# EAGLE schematic LS (EAGLE 8.6.0)
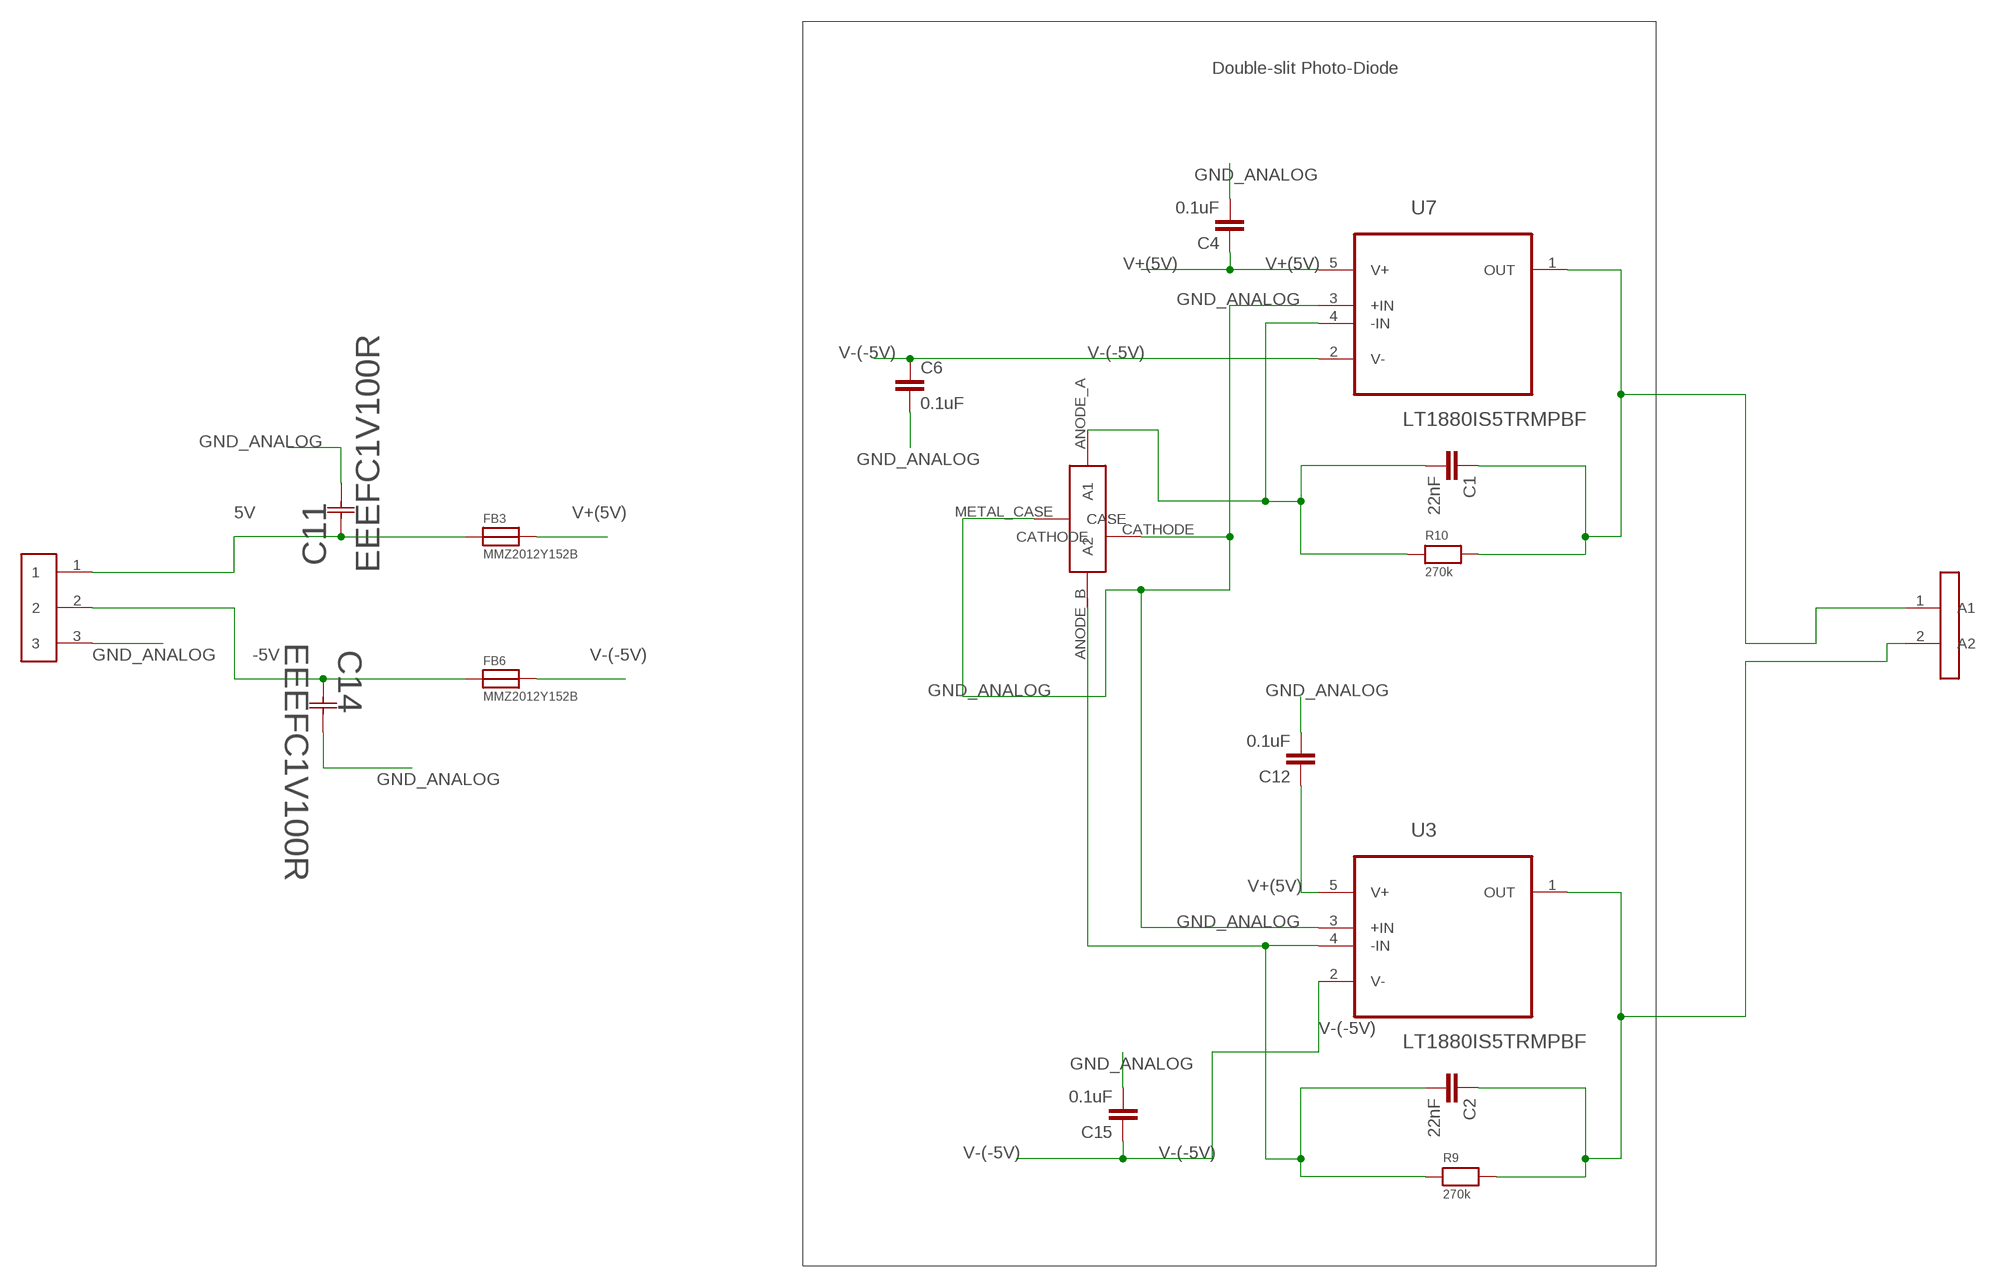
[diagram p0: schematic, sheet 1]

## Parts
C1  22nF  C-EUC0603  [C0603]
C2  22nF  C-EUC0603  [C0603]
C4  0.1uF  C-EUC0603  [C0603]
C6  0.1uF  C-EUC0603  [C0603]
C11  EEEFC1V100R  [CAP_EEFC_C]
C12  0.1uF  C-EUC0603  [C0603]
C14  EEEFC1V100R  [CAP_EEFC_C]
C15  0.1uF  C-EUC0603  [C0603]
FB3  MMZ2012Y152B  FERRITE0805  [0805]
FB6  MMZ2012Y152B  FERRITE0805  [0805]
J2  22-28-8020  [22-28-8020]
R9  270k  RESISTOR0805  [0805]
R10  270k  RESISTOR0805  [0805]
U3  LT1880IS5TRMPBF  [SOT95P280X100-5N]
U7  LT1880IS5TRMPBF  [SOT95P280X100-5N]
U$1  SFH221  [SFH_221]
U$2  PINHD_SMD-3  [PINHD_SMD-3]

## Nets
5V: C11.1 FB3.1 U$2.1
-5V: C14.1 FB6.1 U$2.2
GND_ANALOG: C4.2 C6.2 C11.2 C12.2 C14.2 C15.2 U3.3(+IN) U7.3(+IN) U$1.CATHODE U$1.METAL_CASE(CASE) U$2.3
N$1: C2.1 J2.2(A2) R9.2 U3.1(OUT)
N$11: C2.2 R9.1 U3.4(-IN) U$1.ANODE_B(A2)
N$14: C1.1 J2.1(A1) R10.2 U7.1(OUT)
N$17: C1.2 R10.1 U7.4(-IN) U$1.ANODE_A(A1)
V+(5V): C4.1 C12.1 FB3.2 U3.5(V+) U7.5(V+)
V-(-5V): C6.1 C15.1 FB6.2 U3.2(V-) U7.2(V-)

## Notes on the sheet
- Double-slit Photo-Diode

## Library data of the parts
C1 C2 C4 C6 C12 C15 = rcl:C-EU: CAPACITOR, European symbol; SPICEPREFIX: C
C11 C14 = 10uFElectrolyticSMD:EEEFC1V100R; MANUFACTURER_PART_NUMBER: EEEFC1V100R; VENDOR: Panasonic
FB3 FB6 = microbuilder:FERRITE: Ferrite Bead 0603 MMZ1608B121C - 120 Ohm, 600mA Ferrite Chip - Digikey: 445-2164-1-ND BK1608HW121-T - 120 Ohm, 600mA Ferrite Chip - Digikey: 587-1876-2-ND 0805 HZ0805B272R-10 - 2.7K Ohm @ 100MHz, 200mA 0.8 Ohm DC Resistance - Digikey: 240-2504-1-ND (see also Murata BLM21BD272SN1L)
J2 = PinHD-2:22-28-8020; MANUFACTURER_PART_NUMBER: 22288020; VENDOR: Molex Connector Corporation
R9 R10 = microbuilder:RESISTOR: Resistors 0402 - 0402 Surface Mount Package 22 Ohm 1% 1/16W [Digikey: 311-22.0LRTR-ND] 33 Ohm 5% 1/16W 1.0K 5% 1/16W 1.5K 5% 1/16W 2.0K 1% 1/16W 10.0K 1% 1/16W [Digikey: 311-10.0KLRTR-ND] 10.0K 5% 1/16W [Digikey: RMCF0402JT10K0TR-ND] 12.1K 1% 1/16W [Digikey: 311-22.0LRTR-ND] 100.0K 5% 1/16W 0603 - 0603 Surface Mount Package 0 Ohm 1/10 Watt 1% Resistor 15 Ohm 1/10 Watt 1% Resistor 33 Ohm 1/10 Watt 1% Resistor 49.9 Ohm 1/10 Watt 1% Resistor 100 Ohm 1/10 Watt 1% Resistor 150 Ohm 1/10 Watt 1% Resistor 240 Ohm 1/10 Watt 1% Resistor 390 Ohm 1/10 Watt 1% Resistor 560 Ohm 1/10 Watt 1% Resistor 680 Ohm 1/10 Watt 1% Resistor 750 Ohm 1/10 Watt 1% Resistor 1.0K Ohm 1/10 Watt 1% Resistor 1.5K Ohm 1/10 Watt 1% Resistor 2.0K Ohm 1/10 Watt 1% Resistor 2.2K Ohm 1/10 Watt 1% Resistor 3.3K Ohm 1/10 Watt 1% Resistor 4.7K Ohm 1/10 Watt 1% Resistor 10.0K Ohm 1/10 Watt 1% Resistor 12.0K Ohm 1/10 Watt 1% Resistor 12.1K Ohm 1/10 Watt 1% Resistor 20.0K Ohm 1/10 Watt 1% Resistor 33.0K Ohm 1/10 Watt 1% Resistor 100.0K Ohm 1/10 Watt 1% Resistor 0805 - 0805 Surface Mount Package 0 Ohm 1/8 Watt 1% Resistor 33 Ohm 1/8 Watt 1% Resistor 100 Ohm 1/8 Watt 1% Resistor 150 Ohm 1/8 Watt 1% Resistor 200 Ohm 1/8 Watt 1% Resistor 240 Ohm 1/8 Watt 1% Resistor 330 Ohm 1/8 Watt 1% Resistor 390 Ohm 1/8 Watt 1% Resistor 470 Ohm 1/8 Watt 1% Resistor 1.0K Ohm 1/8 Watt 1% Resistor 1.5K Ohm 1/8 Watt 1% Resistor 2.0K Ohm 1/8 Watt 1% Resistor 4.7K Ohm 1/8 Watt 1% Resistor 5.1K Ohm 1/8 Watt 1% Resistor 5.6K Ohm 1/8 Watt 1% Resistor 10.0K Ohm 1/8 Watt 1% Resistor 22.0K Ohm 1/8 Watt 1% Resistor 33.0K Ohm 1/8 Watt 1% Resistor 100K Ohm 1/8 Watt 1% Resistor 1206 - 1206 Surface Mount Package 2012 - 2010 Surface Mount Package 0.11 Ohm 1/2 Watt 1% Resistor - Digikey: RHM.11UCT-ND
U3 U7 = LT1880IS5:LT1880IS5TRMPBF: Picoamp Input Current Precision Op Amp; DESCRIPTION: Ic Opamp Pico/In Rr/Out Tsot23-5 - Lt1880is5#Trmpbf; DIGI-KEY_PART_NUMBER: LT1880IS5#TRMPBFCT-ND; DIGI-KEY_PURCHASE_URL: https://www.digikey.com/product-detail/en/linear-technology-analog-devices/LT1880IS5-TRMPBF/LT1880IS5-TRMPBFCT-ND/890504?WT.z_cid=ref_snapeda&utm_source=snapeda&utm_medium=aggregator&utm_campaign=buynow; MF: Linear Technology; MP: LT1880IS5#TRMPBF; PACKAGE: TSOT-23 Linear Technology
U$1 = SFH221:SFH221
U$2 = PINHD_SMD-3:PINHD_SMD-3